# EAGLE design NLQHD-SATA Rev 2 (EAGLE 9.7.0)
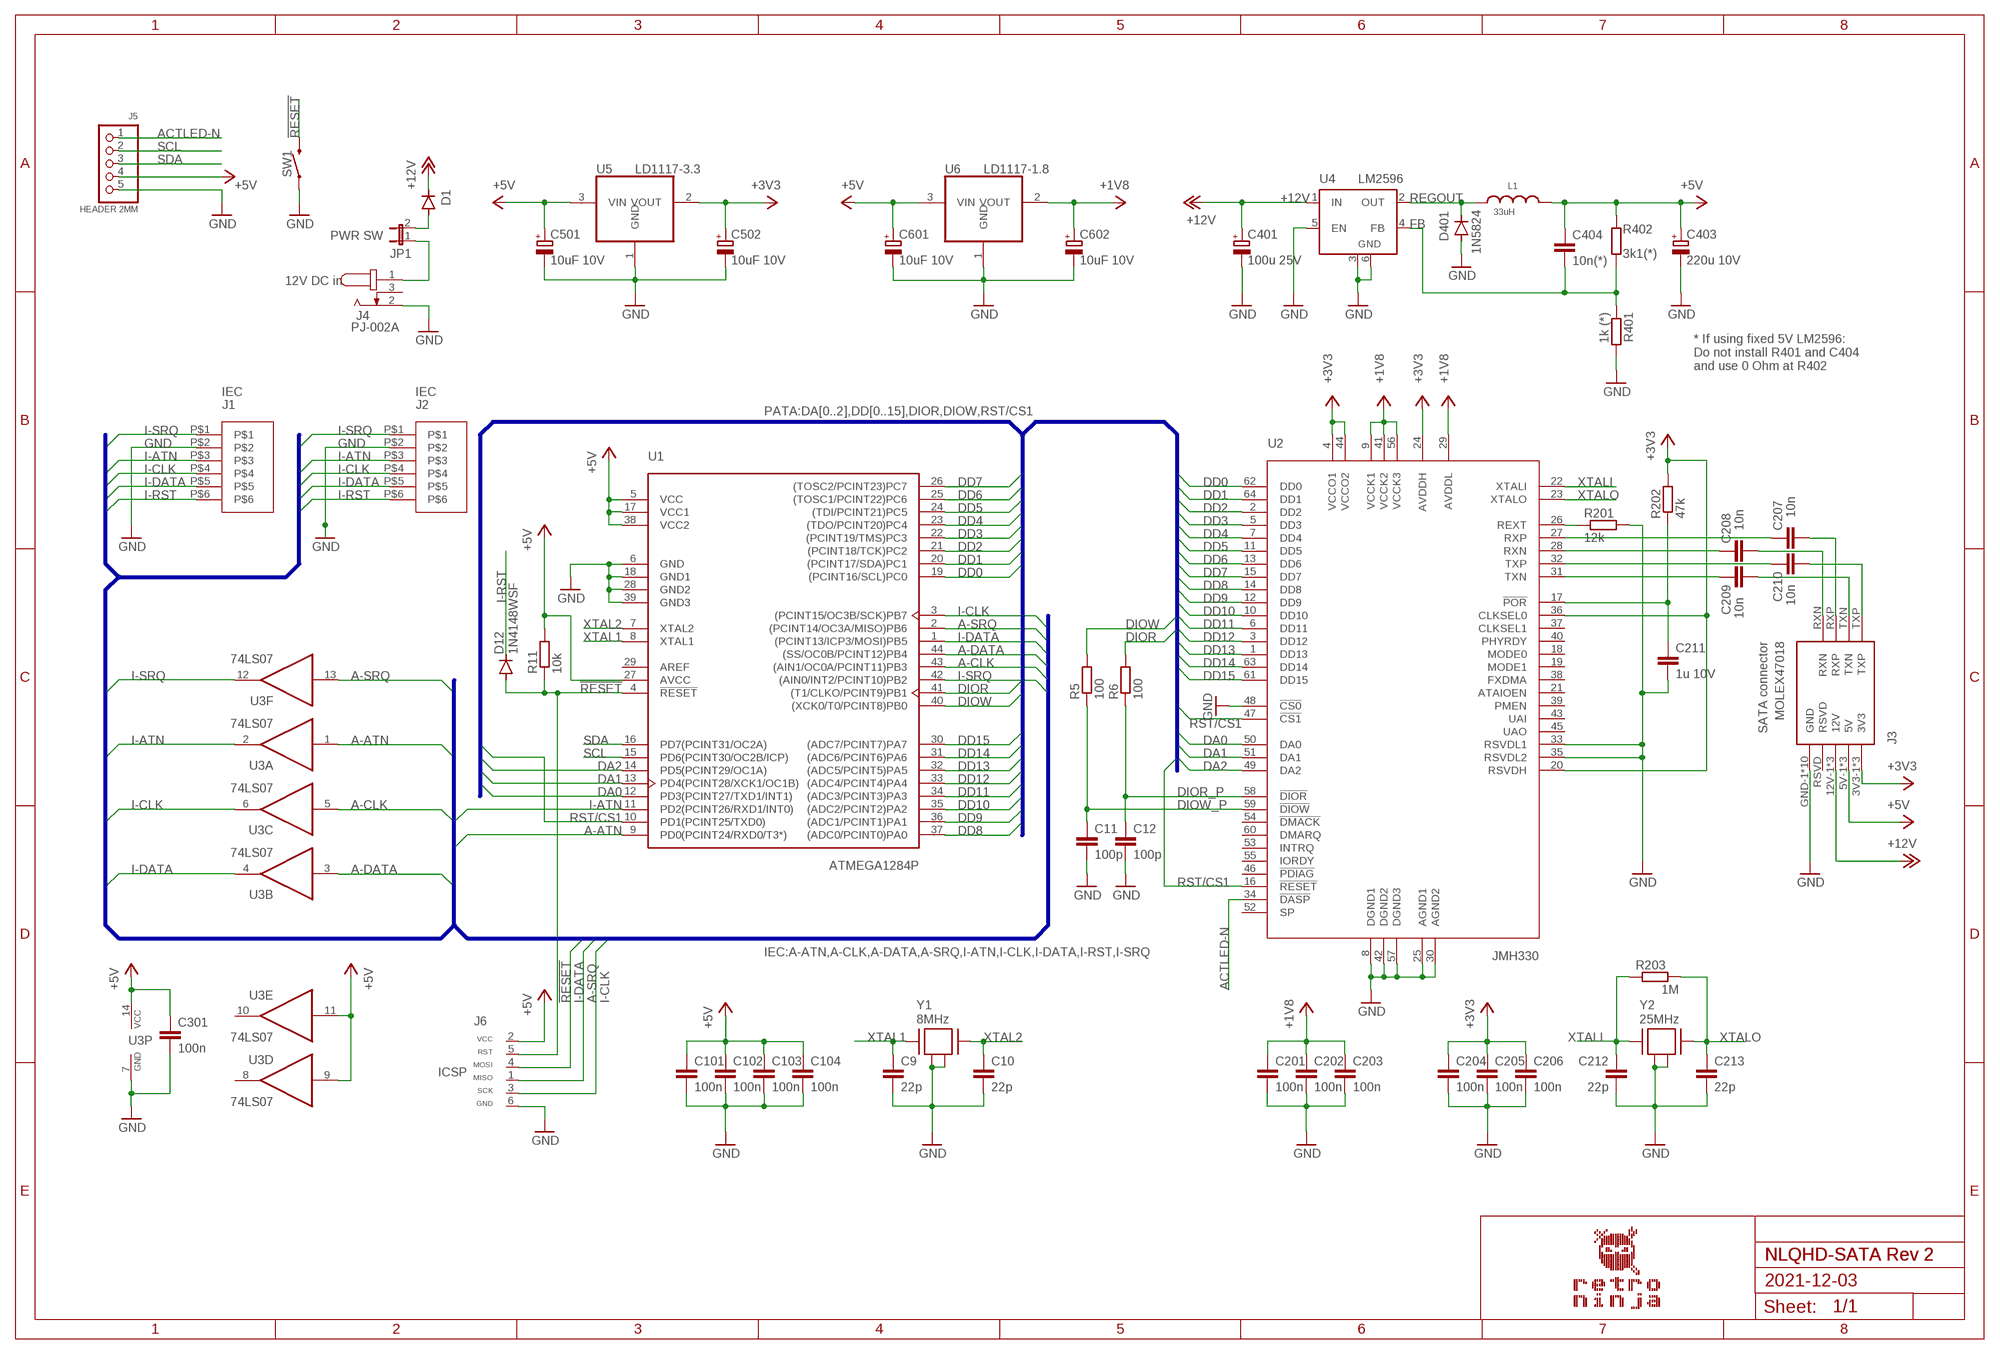
[diagram p0: schematic, sheet 1]

## Parts
C9  22p  C-EUC0805  [C0805]
C10  22p  C-EUC0805  [C0805]
C11  100p  C-EUC0805  [C0805]
C12  100p  C-EUC0805  [C0805]
C101  100n  C-EUC0805  [C0805]
C102  100n  C-EUC0805  [C0805]
C103  100n  C-EUC0805  [C0805]
C104  100n  C-EUC0805  [C0805]
C201  100n  C-EUC0805  [C0805]
C202  100n  C-EUC0805  [C0805]
C203  100n  C-EUC0805  [C0805]
C204  100n  C-EUC0805  [C0805]
C205  100n  C-EUC0805  [C0805]
C206  100n  C-EUC0805  [C0805]
C207  10n  C-EUC0805  [C0805]
C208  10n  C-EUC0805  [C0805]
C209  10n  C-EUC0805  [C0805]
C210  10n  C-EUC0805  [C0805]
C211  1u 10V  C-EUC0805  [C0805]
C212  22p  C-EUC0805  [C0805]
C213  22p  C-EUC0805  [C0805]
C301  100n  C-EUC0805  [C0805]
C401  100u 25V  CAPACITOR_POL_SMD_6.3X7.7  [CAP_POL_SMD_6.3X7.7]
C403  220u 10V  CAPACITOR_POL_SMD_6.3X7.7  [CAP_POL_SMD_6.3X7.7]
C404  10n(*)  C-EUC0805  [C0805]
C501  10uF 10V  CPOL-EUA/3216-18R  [A/3216-18R]
C502  10uF 10V  CPOL-EUA/3216-18R  [A/3216-18R]
C601  10uF 10V  CPOL-EUA/3216-18R  [A/3216-18R]
C602  10uF 10V  CPOL-EUA/3216-18R  [A/3216-18R]
D1  DIODE_SOD-123FL  [SOD-123FL]
D12  1N4148WSF  DIODE_SOD-323F  [SOD-323F]
D401  1N5824  DIODE_SOD-123FL  [SOD-123FL]
J1  DIN-6_PCB  [DIN-6-PCB]
J2  DIN-6_PCB  [DIN-6-PCB]
J3  MOLEX47018  MOLEX47018SATA  [MOLEX47018SATA]
J4  PJ-002A  [CUI_PJ-002A]
J5  HEADER 2MM  HEADER_1X5_2MM_JST  [HEADER_1X5_2MM_JST]
J6  ICSP_CONNECTOR_6_ALT  [HEADER_2X3_ALT]
JP1  JUMPER-2  [HEADER_1X2]
L1  33uH  WE-LHMI_1040_74437368330  [WE-LHMI_1040]
R5  100  R-EU_R0805  [R0805]
R6  100  R-EU_R0805  [R0805]
R11  10k  R-EU_R0805  [R0805]
R201  12k  R-EU_R0805  [R0805]
R202  47k  R-EU_R0805  [R0805]
R203  1M  R-EU_R0805  [R0805]
R401  1k (*)  R-EU_R0805  [R0805]
R402  3k1(*)  R-EU_R0805  [R0805]
SW1  SWITCH_MOMENTARY_6.0X5.0_RIGHT_ANGLE  [SWITCH_MOM_6.0MMX5.0MM_RIGHT_ANGLE]
U1  ATMEGA1284P  ATMEGA1284P-AU  [TQFP-44]
U2  JMH330  [TQFP-64_12X12X1.20]
U3  74LS07  7407_SOIC14  [SOIC14]
U4  LM2596  LM2596S  [TO263-5]
U5  LD1117-3.3  LD1117  [SOT223]
U6  LD1117-1.8  LD1117  [SOT223]
Y1  8MHz  ECX-32  [ECX-32]
Y2  25MHz  ECX-32  [ECX-32]

## Nets
!POR: C211.1 R202.1 U2.17(!POR)
!RESET: D12.A J6.5(RST) R11.1 SW1.2 U1.4(!RESET)
+1V8: C201.1 C202.1 C203.1 C602.+ U2.9(VCCK1) U2.29(AVDDL) U2.41(VCCK2) U2.56(VCCK3) U6.2(VOUT)
+3V3: C204.1 C205.1 C206.1 C502.+ J3.3V3-1(3V3) J3.3V3-2(3V3) J3.3V3-3(3V3) R202.2 U2.4(VCCO1) U2.20(RSVDH) U2.24(AVDDH) U2.36(CLKSEL0) U2.44(VCCO2) U5.2(VOUT)
+5V: C101.1 C102.1 C103.1 C104.1 C301.1 C403.+ C404.1 C501.+ C601.+ J3.5V-1(5V) J3.5V-2(5V) J3.5V-3(5V) J5.4 J6.2(VCC) L1.2 R11.2 R402.2 U1.5(VCC) U1.17(VCC1) U1.27(AVCC) U1.38(VCC2) U3.9(D:I) U3.11(E:I) U3.14(P:VCC) U5.3(VIN) U6.3(VIN)
+12V: C401.+ D1.C J3.12V-1(12V) J3.12V-2(12V) J3.12V-3(12V) U4.1(IN)
+12V-IN: J4.1 JP1.1
A-ATN: U1.9(PD0(PCINT24/RXD0/T3*)) U3.1(A:I)
A-CLK: U1.43((AIN1/OC0A/PCINT11)PB3) U3.5(C:I)
A-DATA: U1.44((SS/OC0B/PCINT12)PB4) U3.3(B:I)
A-SRQ: J6.1(MISO) U1.2((PCINT14/OC3A/MISO)PB6) U3.13(F:I)
ACTLED-N: J5.1 U2.34(!DASP)
DA0: U1.12(PD3(PCINT27/TXD1/INT1)) U2.50(DA0)
DA1: U1.13(PD4(PCINT28/XCK1/OC1B)) U2.51(DA1)
DA2: U1.14(PD5(PCINT29/OC1A)) U2.49(DA2)
DD0: U1.19((PCINT16/SCL)PC0) U2.62(DD0)
DD1: U1.20((PCINT17/SDA)PC1) U2.64(DD1)
DD2: U1.21((PCINT18/TCK)PC2) U2.2(DD2)
DD3: U1.22((PCINT19/TMS)PC3) U2.5(DD3)
DD4: U1.23((TDO/PCINT20)PC4) U2.7(DD4)
DD5: U1.24((TDI/PCINT21)PC5) U2.11(DD5)
DD6: U1.25((TOSC1/PCINT22)PC6) U2.13(DD6)
DD7: U1.26((TOSC2/PCINT23)PC7) U2.15(DD7)
DD8: U1.37((ADC0/PCINT0)PA0) U2.14(DD8)
DD9: U1.36((ADC1/PCINT1)PA1) U2.12(DD9)
DD10: U1.35((ADC2/PCINT2)PA2) U2.10(DD10)
DD11: U1.34((ADC3/PCINT3)PA3) U2.6(DD11)
DD12: U1.33((ADC4/PCINT4)PA4) U2.3(DD12)
DD13: U1.32((ADC5/PCINT5)PA5) U2.1(DD13)
DD14: U1.31((ADC6/PCINT6)PA6) U2.63(DD14)
DD15: U1.30((ADC7/PCINT7)PA7) U2.61(DD15)
DIOR: R6.2 U1.41((T1/CLKO/PCINT9)PB1)
DIOR_P: C12.1 R6.1 U2.58(!DIOR)
DIOW: R5.2 U1.40((XCK0/T0/PCINT8)PB0)
DIOW_P: C11.1 R5.1 U2.59(!DIOW)
FB: C404.2 R401.1 R402.1 U4.4(FB)
GND: C9.2 C10.2 C11.2 C12.2 C101.2 C102.2 C103.2 C104.2 C201.2 C202.2 C203.2 C204.2 C205.2 C206.2 C211.2 C212.2 C213.2 C301.2 C401.- C403.- C501.- C502.- C601.- C602.- D401.A J1.P$2 J2.P$2 J3.GND-1(GND) J3.GND-2(GND) J3.GND-3(GND) J3.GND-4(GND) J3.GND-5(GND) J3.GND-6(GND) J3.GND-7(GND) J3.GND-8(GND) J3.GND-9(GND) J3.GND-10(GND) J4.2 J5.5 J6.6(GND) R201.2 R401.2 SW1.1 U1.6(GND) U1.18(GND1) U1.28(GND2) U1.39(GND3) U2.8(DGND1) U2.25(AGND1) U2.30(AGND2) U2.33(RSVDL1) U2.35(RSVDL2) U2.42(DGND2) U2.48(!CS0) U2.57(DGND3) U3.7(P:GND) U4.3(GND) U4.5(EN) U4.6(GND) U5.1(GND) U6.1(GND) Y1.2 Y1.4 Y2.2 Y2.4
I-ATN: J1.P$3 J2.P$3 U1.11(PD2(PCINT26/RXD1/INT0)) U3.2(A:O)
I-CLK: J1.P$4 J2.P$4 J6.3(SCK) U1.3((PCINT15/OC3B/SCK)PB7) U3.6(C:O)
I-DATA: J1.P$5 J2.P$5 J6.4(MOSI) U1.1((PCINT13/ICP3/MOSI)PB5) U3.4(B:O)
I-RST: D12.C J1.P$6 J2.P$6
I-SRQ: J1.P$1 J2.P$1 U1.42((AIN0/INT2/PCINT10)PB2) U3.12(F:O)
N$1: R201.1 U2.26(REXT)
N$2: D1.A JP1.2
N$4: C207.2 J3.RXP
N$5: C208.2 J3.RXN
N$6: C210.2 J3.TXP
N$7: C209.2 J3.TXN
N$8: C208.1 U2.28(RXN)
N$9: C209.1 U2.31(TXN)
N$10: C210.1 U2.32(TXP)
N$11: C207.1 U2.27(RXP)
REGOUT: D401.C L1.1 U4.2(OUT)
RST/CS1: U1.10(PD1(PCINT25/TXD0)) U2.16(!RESET) U2.47(!CS1)
SCL: J5.2 U1.15(PD6(PCINT30/OC2B/ICP))
SDA: J5.3 U1.16(PD7(PCINT31/OC2A))
XTAL1: C9.1 U1.8(XTAL1) Y1.1
XTAL2: C10.1 U1.7(XTAL2) Y1.3
XTALI: C212.1 R203.1 U2.22(XTALI) Y2.1
XTALO: C213.1 R203.2 U2.23(XTALO) Y2.3
Unconnected: J3.RSVD J4.3 U1.29(AREF) U2.18(MODE0) U2.19(MODE1) U2.21(ATAIOEN) U2.37(CLKSEL1) U2.38(FXDMA) U2.39(PMEN) U2.40(PHYRDY) U2.43(UAI) U2.45(UAO) U2.46(!PDIAG) U2.52(SP) U2.53(INTRQ) U2.54(!DMACK) U2.55(IORDY) U2.60(DMARQ) U3.8(D:O) U3.10(E:O)

## Buses
PATA:DA[0..2],DD[0..15],DIOR,DIOW,RST/CS1
IEC:A-ATN,A-CLK,A-DATA,A-SRQ,I-ATN,I-CLK,I-DATA,I-RST,I-SRQ

## Notes on the sheet
- PWR SW
- 12V DC in
- * If using fixed 5V LM2596:
  Do not install R401 and C404 
  and use 0 Ohm at R402
- IEC | IEC
- SATA connector
- ICSP
- NLQHD-SATA Rev 2
- 2021-12-03

## Library data of the parts
C9-C12 C101-C104 C201-C213 C301 C404 = rcl:C-EU: CAPACITOR, European symbol; SPICEPREFIX: C
C401 C403 = Per (Fusion 360):CAPACITOR_POL
C501 C502 C601 C602 = rcl:CPOL-EU: POLARIZED CAPACITOR, European symbol; SPICEPREFIX: C
D1 D12 D401 = Per (Fusion 360):DIODE
J1 J2 = Per (Fusion 360):DIN-6
J3 = Per (Fusion 360):MOLEX47018SATA
J4 = Per (Fusion 360):PJ-002A: 2.0 mm Center Pin, 2.5 A, Right Angle, Through Hole, Dc Power Jack Connector; MANUFACTURER: CUI INC; STANDARD: Manufacturer recommendations
J5 = Per (Fusion 360):HEADER_1X5
J6 = Per (Fusion 360):ICSP_CONNECTOR: PIN HEADER
JP1 = Per (Fusion 360):JUMPER-2
L1 = Wurth_Power Magnetics_WE-LHMI:WE-LHMI_1040: WE-LHMI SMD Power Inductor Characteristics Compact Design Magnetically shielded High current capability Handles high transient current spikes No acoustic noise and no leakage field Operating temperature: -40°C to +125°C Applications DC/DC Converters for high current power supplies DC/DC Converters for Field Programmable Gate Arrays (FPGA) POL Converters Portable power like PDA, digital camera Mainboards/ graphic cards CPU/ RAM Battery powered devices <https://katalog.we-online.com/media/images/v2/o14803v209%20Family_WE-LHMI_2016.jpg> Details see: https://katalog.we-online.com/en/pbs/WE-LHMI Updated by Yingchun Shan 2019-08-09 2019 (C) Wurth Elektronik; DATASHEET-URL: https://www.we-online.com/catalog/datasheet/74437368330.pdf; FRES: 6MHz; IR: 2.6A; ISAT: 5A; MOUNT: SMT; PART-NUMBER: 74437368330; RDC-MAX: 112mOhm; RDC-TYPE: 92mOhm
R5 R6 R11 R201-R203 R401 R402 = rcl:R-EU_: RESISTOR, European symbol; SPICEPREFIX: R
SW1 = Per (Fusion 360):SWITCH_MOMENTARY
U1 = Per (Fusion 360):ATMEGA1284P-AU: IC MCU 8BIT 128KB FLASH 44TQFP Manufacturer's datasheet <http://ww1.microchip.com/downloads/en/DeviceDoc/ATmega164A_PA-324A_PA-644A_PA-1284_P_Data-Sheet-40002070A.pdf>; CREATED_BY: PCBLayout.com; DIGIKEY_PART_NUMBER: ATMEGA1284P-AU-ND; MANUFACTURER: Microchip Technology; MPN: ATMEGA1284P-AU; PACKAGE: TQFP-44
U2 = Per (Fusion 360):JMH330
U3 = Per (Fusion 360):74*07
U4 = linear:LM2596S: STEP-DOWN VOLTAGE REGULATOR
U5 U6 = PulseOximeterECG_AU:LD1117: 800mA and 1A Low Dropout (LDO) Positive Regulator 1.8V, 2.5V, 2.85V, 3.3V, 5V, and Adj; MF: TEXAS INSTRUMENTS; MPN: REG1117FAKTTT; OC_FARNELL: 1296120; OC_NEWARK: 87H2562
Y1 Y2 = Per (Fusion 360):ECX-32: ECX-32 SMD CRYSTAL The sub miniature ECX-32 is a compact SMD Crystal. The 3.2 x 2.5 x 0.8 mm ceramic package is ideal for LoRa WAN, wireless, and high density applications.

## Board
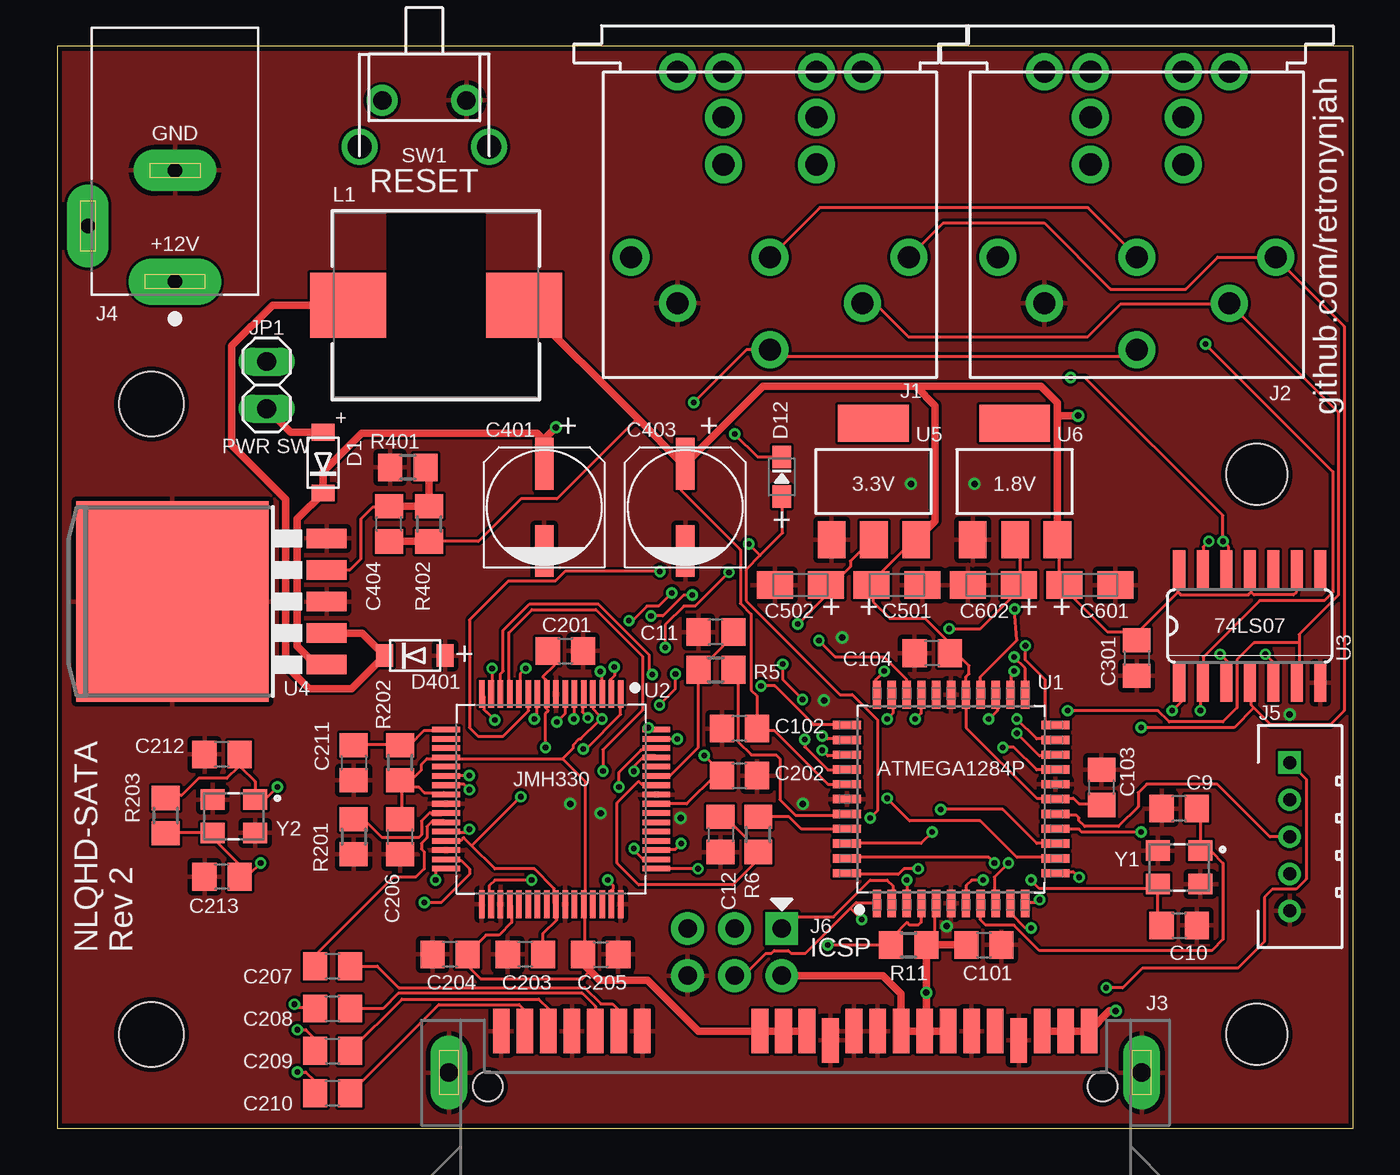
[diagram p1: board, top side]
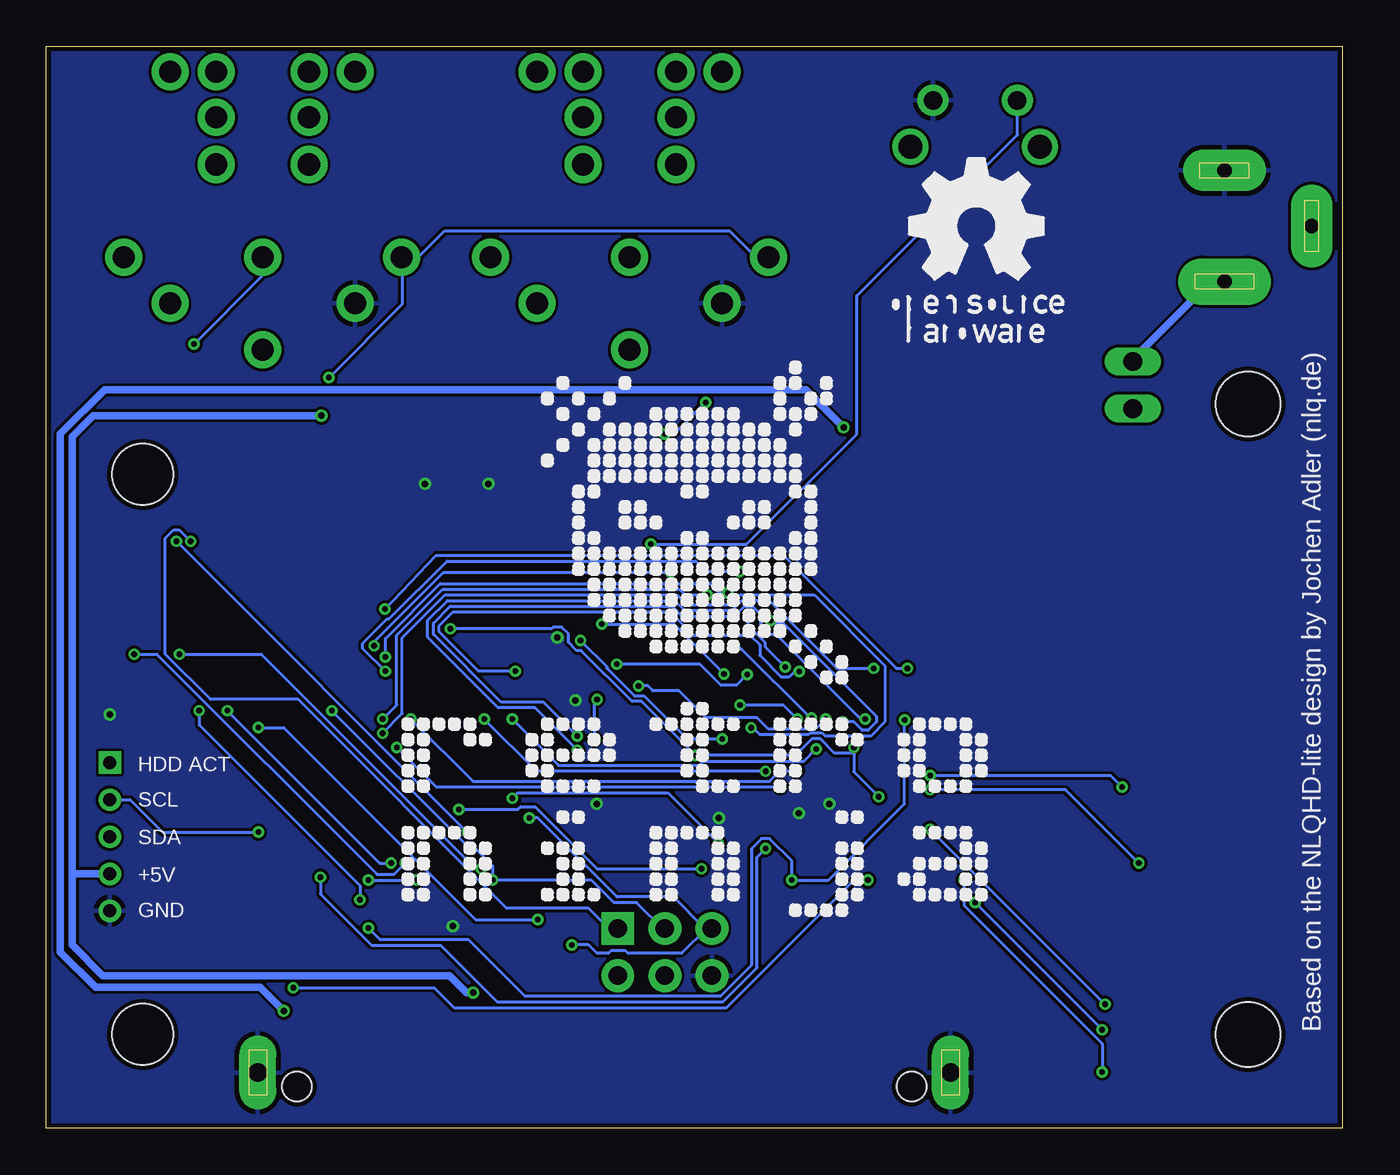
[diagram p2: board, bottom side, seen from below]

Size 69.98 x 58.42 mm. Coordinates in mm from the lower left corner, seen from the top.
Outline: 0,0 69.98,0 69.98,58.42 0,58.42 0,0
Copper layers (1*16): Top 0.035mm / dielectric 1.5mm / Bottom 0.035mm
Design rules "SeeedStudio_2layer_DRU_no_angle_20140221": minimum track width 6mil, minimum drill 12mil, track to track 6mil, track to pad 6mil, pad to pad 6mil, via to via 6mil, smd to smd 0mil, copper to edge 10mil, drill to drill 10mil, minimum pad ring 10mil, minimum via ring 6mil, stop-mask expansion 2mil, vias tented up to drill 100mil, thermal gap 10mil
Holes 3.3 mm at 64.77,5.08 64.77,35.31
Holes 3.5 mm at 5.08,5.08 5.08,39.12

### Footprints (pad centres in the part's own frame; a part is rotated, then mirrored left to right if it is on the bottom)
C0805 = smd 1.3 x 1.5: 1 -0.95,0; 2 0.95,0
CAP_POL_SMD_6.3X7.7 = smd 2.8 x 1: + 2.35,0; - -2.35,0
A/3216-18R = smd 1.95 x 1.5: + 1.375,0; - -1.375,0
SOD-123FL = smd 0.91 x 1.22: A 1.637,0; C -1.637,0
SOD-323F = smd 1.2 x 1: A 1.065,0; C -1.065,0
DIN-6-PCB = drill 1.194 pad 2: P$1 -7.5,2.5; P$2 -5,0; P$3 0,2.5; P$4 5,0; P$5 7.5,2.5; P$6 0,-2.5; P$7 -2.5,7.5; P$8 2.5,7.5; P$9 -2.5,12.5; P$10 2.5,12.5; P$11 -5,12.5; P$12 5,12.5; P$13 -2.5,10.04; P$14 2.5,10.04
MOLEX47018SATA = smd 0.9 x 2.4: 3V3-1 18.48,10.81; 3V3-2 19.75,10.81; 3V3-3 21.02,10.81; 5V-1 26.1,10.81; 5V-2 27.37,10.81; 5V-3 28.64,10.81; 12V-1 33.72,10.81; 12V-2 34.99,10.81; 12V-3 36.26,10.81; GND-1 4.51,10.81; GND-2 8.32,10.81; GND-3 12.13,10.81; GND-4 22.29,10.31; GND-5 23.56,10.81; GND-6 24.83,10.81; GND-7 29.91,10.81; GND-8 32.45,10.31; RSVD 31.18,10.81; RXN 9.59,10.81; RXP 10.86,10.81; TXN 7.05,10.81; TXP 5.78,10.81 | drill 1 pad 2 long: GND-9 1.68,8.57; GND-10 39.1,8.57 | hole 1.6: 36.98,7.81; 3.79,7.81
CUI_PJ-002A = drill 0.8 pad 2.5 long: 1 0,0 | drill 0.8 pad 2.25 long: 2 6,0; 3 3,4.7
HEADER_1X5_2MM_JST = drill 0.7 square: 1 -4,0 | drill 0.7: 2 -2,0; 3 0,0; 4 2,0; 5 4,0
HEADER_2X3_ALT = drill 1 pad 1.778 square: 1 -2.54,-1.27 | drill 1 pad 1.778: 2 -2.54,1.27; 3 0,-1.27; 4 0,1.27; 5 2.54,-1.27; 6 2.54,1.27
HEADER_1X2 = drill 1.016 long: 1 -1.27,0; 2 1.27,0
WE-LHMI_1040 = smd 4.1 x 3.5: 1 -4.75,0; 2 4.75,0
R0805 = smd 1.3 x 1.5: 1 -0.95,0; 2 0.95,0
SWITCH_MOM_6.0MMX5.0MM_RIGHT_ANGLE = drill 1 pad 1.676: 1 -2.275,0; 2 2.275,0 | drill 1.3: 3 -3.5,2.5; 4 3.5,2.5
TQFP-44 = smd 1.5 x 0.45: 1 -5.63,4; 2 -5.63,3.2; 3 -5.63,2.4; 4 -5.63,1.6; 5 -5.63,0.8; 6 -5.63,0; 7 -5.63,-0.8; 8 -5.63,-1.6; 9 -5.63,-2.4; 10 -5.63,-3.2; 11 -5.63,-4; 23 5.63,-4; 24 5.63,-3.2; 25 5.63,-2.4; 26 5.63,-1.6; 27 5.63,-0.8; 28 5.63,0; 29 5.63,0.8; 30 5.63,1.6; 31 5.63,2.4; 32 5.63,3.2; 33 5.63,4 | smd 0.45 x 1.5: 12 -4,-5.63; 13 -3.2,-5.63; 14 -2.4,-5.63; 15 -1.6,-5.63; 16 -0.8,-5.63; 17 0,-5.63; 18 0.8,-5.63; 19 1.6,-5.63; 20 2.4,-5.63; 21 3.2,-5.63; 22 4,-5.63; 34 4,5.63; 35 3.2,5.63; 36 2.4,5.63; 37 1.6,5.63; 38 0.8,5.63; 39 0,5.63; 40 -0.8,5.63; 41 -1.6,5.63; 42 -2.4,5.63; 43 -3.2,5.63; 44 -4,5.63
TQFP-64_12X12X1.20 = smd 1.5 x 0.3: 1 -5.672,3.75; 2 -5.672,3.25; 3 -5.672,2.75; 4 -5.672,2.25; 5 -5.672,1.75; 6 -5.672,1.25; 7 -5.672,0.75; 8 -5.672,0.25; 9 -5.672,-0.25; 10 -5.672,-0.75; 11 -5.672,-1.25; 12 -5.672,-1.75; 13 -5.672,-2.25; 14 -5.672,-2.75; 15 -5.672,-3.25; 16 -5.672,-3.75; 33 5.672,-3.75; 34 5.672,-3.25; 35 5.672,-2.75; 36 5.672,-2.25; 37 5.672,-1.75; 38 5.672,-1.25; 39 5.672,-0.75; 40 5.672,-0.25; 41 5.672,0.25; 42 5.672,0.75; 43 5.672,1.25; 44 5.672,1.75; 45 5.672,2.25; 46 5.672,2.75; 47 5.672,3.25; 48 5.672,3.75 | smd 0.3 x 1.5: 17 -3.75,-5.672; 18 -3.25,-5.672; 19 -2.75,-5.672; 20 -2.25,-5.672; 21 -1.75,-5.672; 22 -1.25,-5.672; 23 -0.75,-5.672; 24 -0.25,-5.672; 25 0.25,-5.672; 26 0.75,-5.672; 27 1.25,-5.672; 28 1.75,-5.672; 29 2.25,-5.672; 30 2.75,-5.672; 31 3.25,-5.672; 32 3.75,-5.672; 49 3.75,5.672; 50 3.25,5.672; 51 2.75,5.672; 52 2.25,5.672; 53 1.75,5.672; 54 1.25,5.672; 55 0.75,5.672; 56 0.25,5.672; 57 -0.25,5.672; 58 -0.75,5.672; 59 -1.25,5.672; 60 -1.75,5.672; 61 -2.25,5.672; 62 -2.75,5.672; 63 -3.25,5.672; 64 -3.75,5.672
SOIC14 = smd 0.66 x 2.032: 1 -3.81,-3.073; 2 -2.54,-3.073; 3 -1.27,-3.073; 4 0,-3.073; 5 1.27,-3.073; 6 2.54,-3.073; 7 3.81,-3.073; 8 3.81,3.073; 9 2.54,3.073; 10 1.27,3.073; 11 0,3.073; 12 -1.27,3.073; 13 -2.54,3.073; 14 -3.81,3.073
TO263-5 = smd 1.067 x 2.159: 1 -3.404,-5.791; 2 -1.702,-5.791; 3 0,-5.791; 4 1.702,-5.791; 5 3.404,-5.791 | smd 10.8 x 10.41: 6 0,2.54
SOT223 = smd 1.499 x 2.007: 1 -2.261,-3.15; 2 0.025,-3.15; 3 2.311,-3.15 | smd 3.81 x 2.007: 4 0,3.15
ECX-32 = smd 1.3 x 1.1: 1 -1.15,-0.9; 2 1.15,-0.9; 3 1.15,0.9; 4 -1.15,0.9

### Placement (x,y rotation side)
C9  60.58,17.27 180 top
C10  60.58,10.96 0 top
C11  35.56,26.8 180 top
C12  35.81,15.88 270 top
C101  50.04,9.91 0 top
C102  36.83,21.59 180 top
C103  56.39,18.41 90 top
C104  47.24,25.65 180 top
C201  27.43,25.78 0 top
C202  36.83,19.05 0 top
C203  25.27,9.4 180 top
C204  21.21,9.4 180 top
C205  29.34,9.4 0 top
C206  18.5,15.75 270 top
C207  14.86,8.76 0 top
C208  14.86,6.48 0 top
C209  14.86,4.19 0 top
C210  14.86,1.91 0 top
C211  16,19.75 270 top
C212  8.89,20.19 180 top
C213  8.89,13.59 180 top
C301  58.28,25.4 270 top
C401  26.29,33.53 90 top
C403  33.91,33.53 90 top
C404  17.91,32.64 90 top
C501  45.34,29.34 180 top
C502  40.13,29.34 0 top
C601  55.75,29.34 180 top
C602  50.55,29.34 0 top
D1  14.35,35.94 90 top
D12  39.12,35.18 270 top
D401  19.3,25.53 0 top
J1  38.48,44.54 0 top
J2  58.29,44.54 0 top
J3  19.46,-5.55 0 top
J4  6.35,45.72 90 top
J5  66.55,15.75 270 top
J6  36.58,9.53 180 top
JP1  11.3,40.13 270 top
L1  20.45,44.45 0 top
R5  35.56,24.77 0 top
R6  37.85,15.88 90 top
R11  45.97,9.91 0 top
R201  16,15.75 270 top
R202  18.5,19.75 270 top
R203  5.84,16.89 270 top
R401  18.92,35.69 180 top
R402  20.07,32.64 270 top
SW1  19.81,55.5 180 top
U1  48.26,17.78 90 top
U2  26.67,17.78 270 top
U3  64.39,27.14 0 top
U4  8.75,28.45 90 top
U5  44.07,34.92 0 top
U6  51.69,34.92 0 top
U$1  [RETRONINJA_30MM]  50.8,11.43 0 bottom
U$2  [OSHW_10MM]  24.51,42.42 0 bottom
Y1  60.58,14.1 180 top
Y2  9.53,16.86 180 top

### Tracks (layer width: path | path; a pad name or v marks a point on that pad's centre or on a via)
!POR
  Top 0.152: C211.1 16,20.73 18.44,20.73 R202.1 18.59,20.73 19.05,20.73 19.81,21.49 20.88,21.49 U2.17
!RESET  (via drill 0.3)
  Top 0.152: U1.4 46.63,12.04 46.63,11.12 46.48,10.97 46.02,10.97 45.87,11.12 45.11,10.36 45.11,9.91 R11.1 v41.6,9.91 | 37.95,30.94 37.19,30.18 37.19,28.5 42.27,23.42 42.92,23.42 44.27,22.07 44.27,17.14 v43.89,16.76 | 37.95,30.94 39.17,32.16 39.17,33.98 D12.A | 37.95,30.94 v37.34,31.55
  Bottom 0.152: v43.89,16.76 43.43,16.76 39.17,12.5 36.12,12.5 34.44,10.82 34.29,10.82 | 34.29,10.82 34.14,10.82 J6.5 34.29,10.82 | v41.6,9.91 40.69,9.91 40.23,9.45 39.62,9.45 39.47,9.6 38.71,9.6 38.56,9.45 35.66,9.45 34.29,10.82 | v37.34,31.55 32.16,31.55 26.21,37.49 26.21,44.96 17.53,53.65 17.53,55.47 SW1.2
+1V8  (via drill 0.3)
  Top 0.152: U2.56 32.46,17.53 33.98,17.53 35.51,19.05 C202.1 35.97,19.05 35.97,19.1 v34.92,20.14 | U6.2 51.97,31.39 51.97,29.41 C602.+ 51.82,29.26 51.82,28.96 49.84,26.98 v48.16,26.98 | C201.1 26.52,25.76 26.82,25.45 26.82,24.99 26.21,24.38 26.36,24.23 26.36,23.47 U2.9 26.36,23.32 26.36,22.71 26.52,22.55 26.36,22.4 v26.36,20.57 | C203.1 26.21,9.45 26.21,10.52 26.98,11.28 26.82,11.43 26.82,12.04 U2.41 26.82,12.19 26.82,12.95 25.76,14.02 23.62,14.02 22.38,15.27 | 22.38,15.27 21.95,15.7 21.79,15.54 21.03,15.54 U2.29 | 22.38,15.27 v25.02,17.91
  Bottom 0.152: 26.36,20.27 26.36,19.25 v25.02,17.91 | 26.36,20.27 v26.36,20.57 | v48.16,26.98 42.7,26.98 42.61,27.06 42.15,27.06 41.79,26.7 41.79,26.24 41.35,25.8 41.09,25.8 38.34,23.05 37.84,23.05 v34.92,20.14 29.51,20.14 28.62,21.03 28.18,21.03 27.42,20.27 26.36,20.27
+3V3  (via drill 0.3)
  Top 0.152: C205.1 28.5,9.45 28.5,12.04 U2.44 28.5,12.19 28.5,18.75 27.28,19.96 | U2.36 24.54,12.04 24.54,11.12 23.85,10.44 23.14,10.44 22.25,9.55 22.25,9.45 C204.1 22.25,9.3 22.25,8.69 22.86,8.08 28.35,8.08 28.77,8.5 | U5.2 44.04,31.55 43.74,31.55 42.82,30.63 42.82,30.33 41.91,29.41 41.6,29.41 C502.+ 41.45,29.26 41.45,28.7 v39.98,27.23 | 18.59,18.44 18.59,18.75 R202.2 | 18.59,18.44 18.59,16.76 C206.1 | 18.59,18.44 18.75,18.44 | 18.75,18.44 19.51,18.44 19.81,18.14 20.88,18.14 U2.24 | 18.59,18.44 R202.2 | 18.75,18.44 19.66,19.36 19.66,19.66 19.96,19.96 20.88,19.96 U2.20 21.03,19.96 27.28,19.96 | 18.75,18.44 R202.2 | 29.26,22.1 v29.41,22.1 | 27.28,19.96 27.87,20.55 27.87,20.71 28.18,21.03 28.26,21.03 29.26,22.02 29.26,22.1 | U2.4 28.96,23.42 28.96,22.62 29.26,22.31 29.26,22.1 | v33.38,24.54 33.38,23.73 v32.51,22.87 v32.51,22.86
  Top 0.406: C205.1 28.45,9.34 28.45,8.83 28.77,8.5 29.27,8 31.88,8 34.62,5.26 J3.3V3-1 J3.3V3-2 J3.3V3-3
  Bottom 0.152: v39.98,27.23 36.07,27.23 v33.38,24.54 | v29.41,22.1 30.18,22.86 v32.51,22.86
+5V  (via drill 0.35)
  Top 0.152: C103.1 56.39,17.53 55.17,17.53 54.86,17.83 53.95,17.83 U1.17 53.8,17.83 52.88,17.83 49.07,21.64 49.07,23.32 U1.27 49.07,23.47 49.07,24.38 49.23,24.54 49.23,24.99 48.62,25.6 48.31,25.6 C104.1 48.16,25.76 48.16,26.21 46.84,27.53 44.96,27.53 44.04,28.45 44.04,29.26 C501.+ 43.96,29.49 46.13,31.65 U5.3 | 64.47,28.96 64.47,30.18 U3.11 | 64.47,28.96 64.62,28.8 66.75,28.8 66.9,28.96 66.9,30.18 U3.9 | 58.37,26.82 58.37,26.36 C301.1 58.37,26.82 | 60.5,28.96 58.37,26.82 | 60.5,28.96 60.5,30.18 U3.14 | 64.47,28.96 64.31,28.8 60.66,28.8 60.5,28.96 | U1.38 42.52,18.59 41.6,18.59 38.71,21.49 37.8,21.49 C102.1 37.78,23.36 37.46,23.67 37.46,27.76 36.88,28.35 36.88,31.24 33.68,34.44 33.68,35.81 C403.+ | U1.5 47.4,12.04 47.4,10.06 R11.2 | U6.3 54.1,31.55 54.1,29.57 54.25,29.41 C601.+ 54.25,29.26 56.69,26.82 58.37,26.82 | 31.32,38.33 26.98,33.98 25.03,33.98 22.73,31.69 R402.2
  Top 0.406: J3.5V-2 J3.5V-3 | J3.5V-2 J3.5V-1 45.56,7.27 44.58,8.26 J6.2 | J3.5V-2 46.92,5.35 v46.92,7.34 R11.2 C101.1 | L1.2 31.32,38.33 33.77,35.88 C403.+ 38.1,40.07 46.35,40.07 | U6.3 54,38.48 | U5.3 47.4,32.79 47.4,39.03 46.35,40.07 | v55.12,38.48 54,38.48 | C404.1 R402.2 | 46.35,40.07 53.11,40.07 54,39.17 54,38.48
  Bottom 0.406: v55.12,38.48 67.44,38.48 68.58,37.34 68.58,13.72 | 68.58,13.72 68.58,9.91 66.93,8.26 48.19,8.26 47.28,7.34 v46.92,7.34 | J5.4 68.55,13.75 68.58,13.72
+12V  (via drill 0.35)
  Top 0.406: J3.12V-1 J3.12V-2 J3.12V-3 56.81,6.35 v57.15,6.35 | v26.92,37.85 26.29,37.21 C401.+ 26.29,37.15 25.91,37.53 16.43,37.53 14.35,35.45 D1.C 12.95,32.91 12.95,26.04 13.95,25.04 U4.1
  Bottom 0.406: v57.15,6.35 58.42,7.62 67.31,7.62 69.22,9.53 69.22,37.49 66.83,39.88 28.96,39.88 v26.92,37.85
+12V-IN
  Bottom 0.406: JP1.1 11.3,41.53 7.11,45.72 J4.1
A-ATN  (via drill 0.3)
  Top 0.152: v51.36,14.33 50.6,13.56 50.6,12.19 U1.9 | v60.2,22.55 60.66,23.01 60.66,23.93 U3.1
  Bottom 0.152: v51.36,14.33 51.97,14.33 v60.2,22.55
A-CLK  (via drill 0.3)
  Top 0.152: v50.6,14.33 50.29,14.63 42.67,14.63 U1.43 | v65.23,25.6 65.68,25.15 65.68,24.08 U3.5
  Bottom 0.152: v50.6,14.33 51.21,13.72 52.12,13.72 64.01,25.6 v65.23,25.6
A-DATA  (via drill 0.3)
  Top 0.152: v46.48,14.02 45.72,14.02 45.41,13.72 42.67,13.72 U1.44 | v62.79,25.6 63.25,25.15 63.25,24.08 U3.3
  Bottom 0.152: v46.48,14.02 46.79,14.02 58.37,25.6 v62.79,25.6
A-SRQ  (via drill 0.3)
  Top 0.152: U1.2 45.11,12.19 45.11,13.11 44.81,13.41 43.89,13.41 41.91,11.43 39.78,11.43 39.17,10.82 J6.1 | v62.18,31.7 61.87,31.39 61.87,30.33 U3.13
  Bottom 0.152: v62.18,31.7 62.79,32.31 63.09,32.31 63.55,31.85 63.55,25.6 61.11,23.16 56.39,23.16 45.11,11.89 40.69,11.89 39.62,10.82 39.17,10.82 J6.1
ACTLED-N  (via drill 0.3)
  Top 0.152: v25.6,13.41 23.62,13.41 23.32,13.11 23.32,12.19 U2.34 | v56.64,7.59 57.53,7.59 58.6,8.66 63.75,8.66 65.18,10.08 65.18,12.47 65.62,12.91 66.89,12.91 67.44,13.46 67.44,18.86 J5.1
  Bottom 0.152: v25.6,13.41 26.36,13.41 33.25,6.53 47.95,6.53 49.02,7.59 v56.64,7.59
DA0  (via drill 0.3)
  Top 0.152: v55.17,13.56 54.86,13.87 53.95,13.87 U1.12 | v31.14,15.11 31.14,15.01 31.62,14.53 U2.50
  Bottom 0.152: v55.17,13.56 55.17,12.65 52.4,9.88 48.68,9.88 45.63,6.83 33.45,6.83 31.6,8.68 31.6,14.65 v31.14,15.11
DA1  (via drill 0.3)
  Top 0.152: v33.68,15.39 33.38,15.09 32.46,15.09 U2.51 | U1.13 53.8,14.63 51.82,14.63 49.84,16.61 46.02,16.61 v44.81,17.83
  Bottom 0.152: v33.68,15.39 36.37,18.09 44.55,18.09 v44.81,17.83
DA2  (via drill 0.3)
  Top 0.152: v34.59,14.02 32.46,14.02 U2.49 | v47.7,17.22 51.05,17.22 52.88,15.39 53.8,15.39 U1.14
  Bottom 0.152: v34.59,14.02 40.23,14.02 43.59,17.37 44.35,17.37 44.5,17.22 v47.7,17.22
DD0  (via drill 0.3)
  Top 0.152: v51.05,20.57 51.66,20.57 52.88,19.36 53.8,19.36 U1.19 | U2.62 31.66,20.53 31.56,20.42 31.51,20.42 30.91,19.82 30.91,19.81 30.33,19.23 v30.33,18.44
  Bottom 0.152: v30.33,18.44 48.92,18.44 v51.05,20.57
DD1  (via drill 0.3)
  Top 0.152: v51.82,21.34 53.03,20.12 53.8,20.12 U1.20 | U2.64 32.02,21.53 v31.92,21.64
  Bottom 0.152: v51.82,21.34 50.75,22.4 50.75,26.5 48.45,28.8 35.92,28.8 35.38,28.27 33.07,28.27 32.53,28.81 28.5,28.81 24.69,24.99 24.69,21.95 25.45,21.18 27.91,21.18 28.05,21.33 28.75,21.33 28.82,21.26 31.44,21.26 31.82,21.64 v31.92,21.64
DD2  (via drill 0.3)
  Top 0.152: v30.07,24.92 30.07,24.43 29.87,24.23 29.87,23.47 U2.2 | v34.29,28.8 33.83,28.8 32.7,27.67 v32.06,27.67 | v51.82,22.1 52.88,21.03 53.8,21.03 U1.21
  Bottom 0.152: v51.82,22.1 51.05,22.86 51.05,26.63 48.58,29.11 35.79,29.11 35.49,28.8 v34.29,28.8 | v30.07,24.92 31.14,25.98 31.14,26.23 32.06,27.15 v32.06,27.67
DD3  (via drill 0.3)
  Top 0.152: v36.27,30.02 34.44,28.19 33.83,28.19 32.82,27.18 v32.82,25.96 | v52.27,26.06 52.27,25.3 53.34,24.23 53.34,21.95 53.49,21.79 53.8,21.79 U1.22 | U2.5 28.35,23.32 28.35,22.47 v28.65,22.17
  Bottom 0.152: v28.65,22.17 28.72,22.17 32.52,25.96 v32.82,25.96 | v52.27,26.06 52.27,26.27 48.52,30.02 v36.27,30.02
DD4  (via drill 0.3)
  Top 0.152: v26.98,21.95 27.43,22.4 27.43,23.32 U2.7 | v51.66,25.45 52.27,24.84 52.27,23.47 U1.23 | v33.18,28.91 32.47,28.2 31.84,28.2 31.05,27.41 v30.86,27.41
  Bottom 0.152: v26.98,21.95 26.36,21.95 25.91,21.49 25.6,21.49 25.15,21.95 25.15,22.25 30.18,27.28 30.73,27.28 v30.86,27.41 | v33.18,28.91 33.64,28.91 34.14,29.41 48.7,29.41 51.66,26.45 v51.66,25.45
DD5  (via drill 0.3)
  Top 0.152: v51.66,24.69 51.51,24.54 51.51,23.47 U1.24 | U2.11 25.45,23.32 25.45,22.55 24.08,21.18 22.71,21.18 22.25,21.64 22.25,27.46 24.34,29.55 26.88,29.55 27.41,30.07 v32.54,30.07
  Bottom 0.152: v32.54,30.07 34.34,30.07 34.9,30.63 48.34,30.63 51.47,27.51 51.58,27.51 52.88,26.2 52.88,25.91 v51.66,24.69
DD6  (via drill 0.3)
  Top 0.152: v50.29,22.1 50.75,22.55 50.75,23.32 U1.25 | U2.13 24.38,23.47 24.38,26.77 25.63,28.02 29.08,28.02 31.6,25.5 31.6,22.58 29.46,20.45 v29.46,19.3
  Bottom 0.152: v50.29,22.1 46.94,18.75 30.92,18.75 30.36,19.3 v29.46,19.3
DD7  (via drill 0.3)
  Top 0.152: v23.47,24.84 23.47,23.47 U2.15 | v51.69,28.04 51.82,26.36 49.84,24.38 49.84,23.47 U1.26
  Bottom 0.152: v23.47,24.84 24.08,24.84 30.18,30.94 48.92,30.94 v51.69,28.04
DD8  (via drill 0.3)
  Top 0.152: v40.36,21.01 40.36,20.6 41.6,19.36 42.52,19.36 U1.37 | U2.14 23.93,23.47 23.93,24.54 24.08,24.69 24.08,26.9 25.5,28.32 29.2,28.32 31.95,25.57 31.95,24.69 v32.13,24.51 | v40.23,23.16 39.17,24.23 v39.17,25.07
  Bottom 0.152: v40.23,23.16 40.36,23.04 v40.36,21.01 | v39.17,25.07 v39.17,25.06 34.66,25.06 33.53,23.93 32.72,23.93 v32.13,24.51
DD9  (via drill 0.3)
  Top 0.152: v25.3,24.84 24.99,24.54 24.99,23.47 U2.12 | v41.3,20.42 41.6,20.12 42.52,20.12 U1.36
  Bottom 0.152: v25.3,24.84 27.28,24.84 30.94,28.5 32.41,28.5 32.95,27.96 35.51,27.96 36.05,28.5 48.31,28.5 49.38,27.43 49.38,26.52 45.57,22.71 43.59,22.71 v41.3,20.42
DD10  (via drill 0.3)
  Top 0.152: v25.76,22.1 25.91,22.25 25.91,23.32 U2.10 | v41.3,21.18 41.45,21.18 41.6,21.03 42.52,21.03 U1.35
  Bottom 0.152: v41.3,21.18 43.13,23.01 45.41,23.01 49.07,26.67 49.07,27.28 48.16,28.19 36.17,28.19 35.64,27.66 32.82,27.66 32.28,28.2 31.84,28.2 31.4,27.76 31.4,27.19 30.87,26.67 30.56,26.67 25.99,22.1 v25.76,22.1
DD11  (via drill 0.3)
  Top 0.152: v27.89,22.1 27.89,23.32 U2.6 | U1.34 42.52,21.79 40.84,21.79 38.74,23.89 v38,23.89
  Bottom 0.152: v38,23.89 37.49,23.89 37.22,23.62 35.81,23.62 34.36,22.17 31.6,22.17 30.99,21.57 28.95,21.57 28.88,21.64 28.35,21.64 v27.89,22.1
DD12  (via drill 0.3)
  Top 0.152: v44.65,24.69 44.2,24.23 44.2,23.47 U1.33 | U2.3 29.41,23.47 29.41,24.56 v29.31,24.66
  Bottom 0.152: v44.65,24.69 46.63,24.69 48.77,26.82 48.77,27.13 48.01,27.89 36.3,27.89 35.03,26.62 31.97,26.62 31.45,26.1 31.45,25.54 30.3,24.38 29.85,24.38 29.57,24.66 v29.31,24.66
DD13  (via drill 0.3)
  Top 0.152: v44.81,22.1 45.11,22.4 45.11,23.32 U1.32 | v28.4,20.49 28.56,20.49 30.42,22.35 U2.1
  Bottom 0.152: v44.81,22.1 42.32,19.61 34.7,19.61 34.48,19.84 29.06,19.84 v28.4,20.49
DD14  (via drill 0.3)
  Top 0.152: v33.48,21.03 32.46,21.03 U2.63 | U1.31 45.87,23.47 45.87,24.23 44.65,25.45 42.01,25.45 v41.13,26.34
  Bottom 0.152: v33.48,21.03 35.38,21.03 37.71,23.36 38.22,23.36 39.7,24.84 39.7,24.91 v41.13,26.34
DD15  (via drill 0.3)
  Top 0.152: v46.33,22.1 46.63,22.4 46.63,23.32 U1.30 | U2.61 32.31,20.12 31.71,20.12 31.14,19.55 v31.14,19.28
  Bottom 0.152: v31.14,19.28 31.16,19.3 43.54,19.3 v46.33,22.1
DIOR
  Top 0.152: U1.41 42.52,16.15 40.18,16.15 39.51,16.82 R6.2
DIOR_P
  Top 0.152: C12.1 35.81,16.76 36.12,16.76 37.19,15.7 37.19,15.54 37.8,14.94 R6.1 37.8,14.78 37.8,14.48 36.47,13.16 31.39,13.16 30.23,14.33 30.23,17.58 31.39,18.75 31.55,18.59 32.31,18.59 U2.58
DIOW
  Top 0.152: U1.40 42.52,16.92 39.85,16.92 39.01,17.75 39.01,19.96 38.81,20.17 37.48,20.17 36.76,20.89 36.76,24.51 36.58,24.69 R5.2
DIOW_P
  Top 0.152: U2.59 32.46,19.05 33.09,19.05 34.39,20.36 34.59,20.57 34.59,24.75 R5.1 34.75,24.84 35.97,26.06 35.97,26.21 36.42,26.67 C11.1
FB
  Top 0.152: U4.4 15.8,30.15 16.38,30.73 16.38,32.89 17.02,33.53 17.85,33.53 C404.2
  Top 0.406: C404.2 R402.1 20.07,35.49 R401.1
GND  (via drill 0.35)
  other vias: 41.4,23.11 42.38,26.5 66.55,22.35 46.1,34.8 49.53,34.8 40.26,17.53 29.34,17.02 27.69,17.53 33.66,16.76 48.02,10.92
  pour Top: 0.08,0.08 69.9,0.08 69.9,58.34 0.08,58.34
  pour Bottom: 0.08,0.08 69.9,0.08 69.9,58.34 0.08,58.34
I-ATN  (via drill 0.3)
  Top 0.152: v53.03,12.34 52.88,12.19 52.27,12.19 U1.11 | v61.72,22.55 61.72,23.93 U3.2 61.87,24.08 61.87,25.45 64.92,28.5 68.43,28.5 68.89,28.96 68.89,35.46 v62,42.34 | J2.P$3 58.29,47.07 55.65,49.71 41.17,49.71 38.56,47.09 J1.P$3
  Bottom 0.152: v53.03,12.34 53.03,13.11 61.72,21.79 v61.72,22.55 | v62,42.34 58.37,45.97 58.37,46.94 J2.P$3
I-CLK  (via drill 0.3)
  Top 0.152: v45.87,13.41 45.87,12.19 U1.3 | 67.06,26.21 67.06,26.67 69.19,28.8 69.19,38.64 J2.P$4 63.25,44.5 57.4,44.5 55.63,42.72 45.97,42.72 44.2,44.5 43.59,44.5 J1.P$4 | 67.06,26.21 67.06,24.08 U3.6 | v54.56,22.55 59.44,22.55 60.05,21.95 62.94,21.95 63.7,22.71 63.7,25.3 64.62,26.21 67.06,26.21
  Bottom 0.152: J6.3 36.58,10.67 38.1,12.19 39.32,12.19 40.54,13.41 v45.87,13.41 45.87,14.17 47.09,15.39 47.4,15.39 v54.56,22.55
I-DATA  (via drill 0.3)
  Top 0.152: 42.82,11.89 40.39,9.45 39.62,9.45 39.47,9.6 38.71,9.6 38.56,9.45 38.25,9.45 37.19,8.38 36.58,8.38 J6.4 | 42.82,11.89 43.13,12.19 44.2,12.19 U1.1 | 64.62,22.71 65.53,21.79 68.73,21.79 69.49,22.55 69.49,43.31 65.82,46.98 J2.P$5 | 64.62,22.71 64.47,22.86 64.47,23.93 U3.4 | v43.43,11.28 42.82,11.89 | v58.52,21.64 63.55,21.64 64.62,22.71 | J2.P$5 62.66,47.04 60.94,45.31 56.87,45.31 53.29,48.9 47.84,48.9 J1.P$5 | J2.P$5
  Bottom 0.152: v43.43,11.28 46.79,11.28 57.15,21.64 v58.52,21.64
I-RST  (via drill 0.3)
  Top 0.152: v36.58,37.49 37.8,36.27 39.01,36.27 D12.C | v34.37,39.19 37.22,42.04 J1.P$6 38.84,41.68 57.93,41.68 J2.P$6
  Bottom 0.152: v36.58,37.49 36.07,37.49 v34.37,39.19
I-SRQ  (via drill 0.3)
  Top 0.152: v47.24,16 46.63,15.39 42.67,15.39 U1.42 | U3.12 63.25,30.33 63.25,31.39 v62.94,31.7 62.94,33.1 55.5,40.54 v54.71,40.54
  Bottom 0.152: J1.P$1 31.09,47.09 31.7,47.09 33.07,48.46 48.46,48.46 49.84,47.09 50.75,47.09 J2.P$1 50.75,46.94 50.75,44.5 v54.71,40.54 | v62.94,31.7 v47.24,16
N$1
  Top 0.152: R201.1 16,16.61 16.61,16.61 17.53,15.7 19.51,15.7 19.66,15.85 19.66,16.61 20.12,17.07 20.27,16.92 20.73,16.92 20.88,17.07 U2.26
N$2
  Top 0.406: D1.A 12.59,37.58 JP1.2
N$4
  Top 0.152: C207.2 17.27,8.76 18.44,7.6 28.48,7.6 29.34,6.73 29.97,6.73 30.32,6.38 J3.RXP
N$5
  Top 0.152: J3.RXN 29.05,6.59 28.35,7.29 18.4,7.29 17.59,6.48 C208.2
N$6
  Top 0.152: C210.2 20.59,6.68 24.94,6.68 25.24,6.38 J3.TXP
N$7
  Top 0.152: J3.TXN 26.54,5.29 26.54,6.43 25.99,6.99 18.61,6.99 C209.2
N$8  (via drill 0.3)
  Top 0.152: v12.8,6.71 12.95,6.55 13.87,6.55 C208.1 | v22.25,16.15 22.1,16 21.03,16 U2.28
  Bottom 0.152: v22.25,16.15 v12.8,6.71
N$9  (via drill 0.3)
  Top 0.152: v12.95,5.33 13.41,5.33 13.87,4.88 13.87,4.27 C209.1 | v19.81,12.19 20.73,12.19 22.25,13.72 22.25,14.02 21.79,14.48 21.03,14.48 U2.31
  Bottom 0.152: v19.81,12.19 v12.95,5.33
N$10  (via drill 0.3)
  Top 0.152: v12.95,3.05 13.41,3.05 13.87,2.59 13.87,1.98 C210.1 | v20.42,13.41 20.42,13.87 20.57,14.02 20.88,14.02 U2.32
  Bottom 0.152: v12.95,3.05 12.95,4.57 20.42,12.04 v20.42,13.41
N$11
  Top 0.152: C207.1 14.02,8.84 14.02,9.45 18.14,13.56 19.36,13.56 19.81,14.02 19.81,14.94 19.66,15.09 19.66,15.39 19.96,15.7 19.96,16.31 20.27,16.61 20.88,16.61 U2.27
REGOUT
  Top 0.406: U4.2 16.45,26.75 D401.C 15.89,23.75 13.59,23.75 12.32,25.02 12.32,33.98 9.42,36.88 9.42,42.25 11.63,44.45 L1.1
RST/CS1  (via drill 0.3)
  Top 0.152: v29.72,13.41 30.02,13.11 30.02,12.95 29.87,12.8 29.87,12.19 U2.47 | v52.58,10.82 52.27,10.82 51.51,11.58 51.51,12.04 U1.10 | U2.16 23.04,23.33 23.04,22.61 23.18,22.47 23.2,22.47 v23.62,22.05
  Bottom 0.152: v23.62,22.05 23.62,17.53 27.74,13.41 v29.72,13.41 29.72,14.45 30.91,15.65 31.36,15.65 31.9,15.1 31.9,8.81 33.57,7.14 44.12,7.14 47.17,10.19 51.94,10.19 v52.58,10.82
SCL  (via drill 0.3)
  Top 0.152: v58.52,16 55.32,16 55.17,16.15 53.95,16.15 U1.15
  Bottom 0.152: v58.52,16 63.7,16 65.45,17.75 J5.2
SDA
  Top 0.152: U1.16 53.95,16.92 55.02,16.92 55.17,16.76 55.17,16.61 55.47,16.31 57.3,16.31 58.37,17.37 58.37,18.14 58.83,18.59 62.64,18.59 65.48,15.75 J5.3
XTAL1
  Top 0.152: C9.1 61.57,17.22 61.72,17.07 61.72,15.09 Y1.1 61.87,14.94 62.33,14.94 62.94,14.33 62.94,10.21 62.33,9.6 53.03,9.6 51.66,10.97 50.14,10.97 49.84,11.28 49.84,12.04 U1.8
XTAL2  (via drill 0.3)
  Top 0.152: 59.44,12.95 59.44,11.12 59.59,10.97 C10.1 | 59.44,12.95 59.44,13.11 Y1.3 59.44,12.95 | v49.99,13.41 49.38,13.41 49.07,13.11 49.07,12.19 U1.7 | v52.58,13.41 53.03,12.95 59.44,12.95
  Bottom 0.152: v52.58,13.41 v49.99,13.41
XTALI  (via drill 0.3)
  Top 0.152: 9.91,19.81 9.91,20.12 C212.1 9.91,19.81 | 9.91,19.81 9.91,19.51 10.67,18.75 10.67,17.83 Y2.1 10.82,17.83 11.28,17.83 v11.89,18.44 | 9.91,19.81 9.75,19.66 9.75,19.51 9.14,18.9 7.62,18.9 6.71,17.98 5.94,17.98 R203.1 | v22.25,19.05 21.03,19.05 U2.22
  Bottom 0.152: v22.25,19.05 12.5,19.05 v11.89,18.44
XTALO  (via drill 0.3)
  Top 0.152: R203.2 5.94,16 8.23,16 Y2.3 8.23,15.85 9.75,14.33 9.75,13.72 C213.1 9.91,13.72 10.36,13.72 v10.97,14.33 | v22.25,18.29 21.95,18.59 21.03,18.59 U2.23
  Bottom 0.152: v22.25,18.29 14.94,18.29 v10.97,14.33

### Text on the board
tPlace: GND | RESET | +12V | + | + | + | PWR SW | + | 3.3V | 1.8V | + | + | + | + | + | ATMEGA1284P | ICSP
bPlace: Based on the NLQHD-lite design by Jochen Adler (nlq.de) | HDD ACT | SCL | SDA | +5V | GND
tNames: github.com/retronynjah | NLQHD-SATA / Rev 2